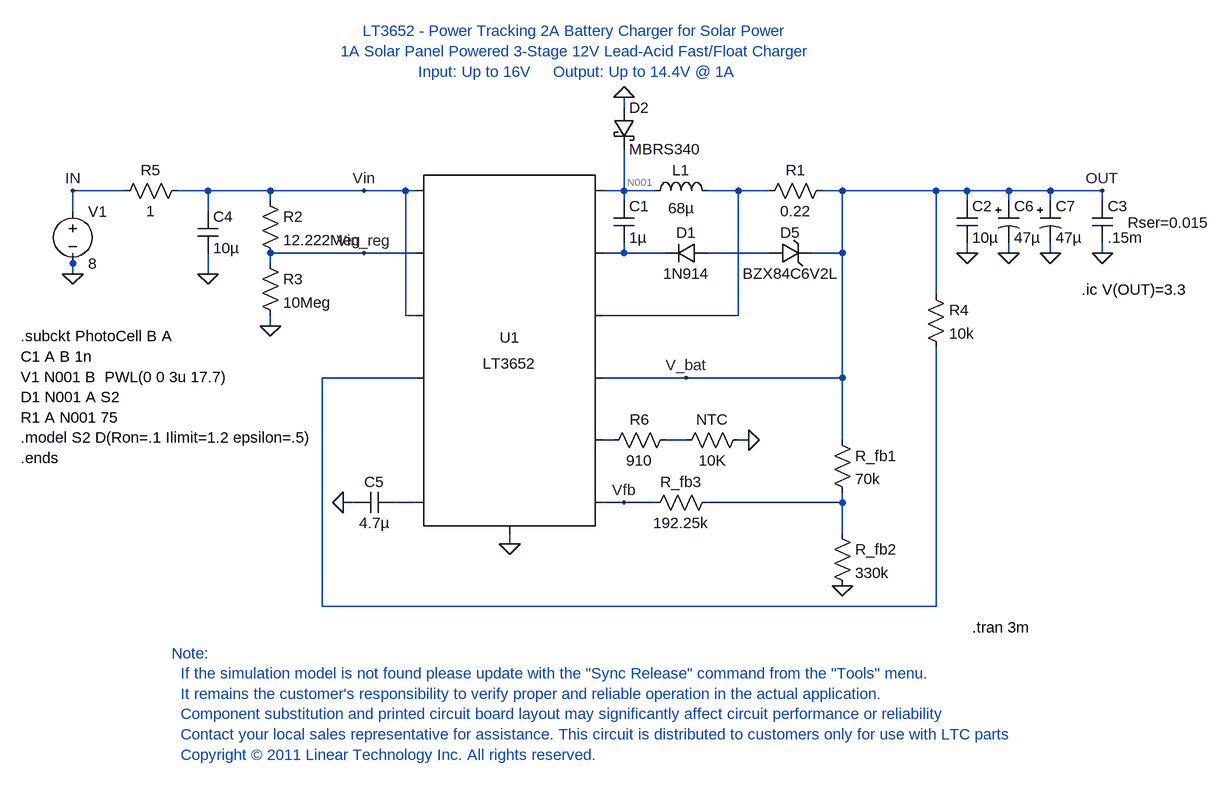
[diagram p0: schematic LT3652_TA04_const voltage source.asc]
LT3652_TA04_const voltage source.asc, the LTspice schematic file:
Version 4
SHEET 1 1484 932
WIRE 400 -192 400 -208
WIRE -368 -64 -448 -64
WIRE -240 -64 -288 -64
WIRE -144 -64 -240 -64
WIRE 0 -64 -144 -64
WIRE 64 -64 0 -64
WIRE 80 -64 64 -64
WIRE 400 -64 400 -128
WIRE 400 -64 368 -64
WIRE 448 -64 400 -64
WIRE 576 -64 528 -64
WIRE 624 -64 576 -64
WIRE 736 -64 704 -64
WIRE 880 -64 736 -64
WIRE 928 -64 880 -64
WIRE 992 -64 928 -64
WIRE 1056 -64 992 -64
WIRE 1136 -64 1056 -64
WIRE -144 -48 -144 -64
WIRE 400 -48 400 -64
WIRE 928 -48 928 -64
WIRE 992 -48 992 -64
WIRE 1056 -48 1056 -64
WIRE 1136 -48 1136 -64
WIRE -448 -32 -448 -64
WIRE -240 -32 -240 -64
WIRE 0 32 -144 32
WIRE 80 32 0 32
WIRE 400 32 400 16
WIRE 400 32 368 32
WIRE 464 32 400 32
WIRE 624 32 528 32
WIRE 736 32 736 -64
WIRE 736 32 688 32
WIRE 928 32 928 16
WIRE 992 32 992 16
WIRE 1056 32 1056 16
WIRE 1136 32 1136 16
WIRE -448 48 -448 32
WIRE -144 48 -144 32
WIRE -448 64 -448 48
WIRE -240 64 -240 32
WIRE 880 96 880 -64
WIRE 64 128 64 -64
WIRE 80 128 64 128
WIRE 576 128 576 -64
WIRE 576 128 368 128
WIRE -144 144 -144 128
WIRE 80 224 -64 224
WIRE 496 224 368 224
WIRE 736 224 736 32
WIRE 736 224 496 224
WIRE 384 320 368 320
WIRE 496 320 464 320
WIRE 592 320 576 320
WIRE 736 320 736 224
WIRE -16 416 -32 416
WIRE 80 416 48 416
WIRE 400 416 368 416
WIRE 448 416 400 416
WIRE 736 416 736 400
WIRE 736 416 528 416
WIRE 736 464 736 416
WIRE 224 480 224 464
WIRE -64 576 -64 224
WIRE 880 576 880 176
WIRE 880 576 -64 576
FLAG 224 480 0
FLAG 400 -208 0
FLAG -240 64 0
FLAG -32 416 0
FLAG 592 320 0
FLAG 928 32 0
FLAG 1136 32 0
FLAG -448 -64 IN
FLAG -448 64 0
FLAG 1136 -64 OUT
FLAG -144 144 0
FLAG 992 32 0
FLAG 736 544 0
FLAG 1056 32 0
FLAG 0 32 Vin_reg
FLAG 0 -64 Vin
FLAG 496 224 V_bat
FLAG 400 416 Vfb
DATAFLAG 464 128 ""
SYMBOL PowerProducts\\LT3652 224 176 R0
SYMATTR InstName U1
SYMBOL res 608 -48 R270
WINDOW 0 32 56 VTop 2
WINDOW 3 0 56 VBottom 2
SYMATTR InstName R1
SYMATTR Value 0.22
SYMBOL cap 384 -48 R0
SYMATTR InstName C1
SYMATTR Value 1µ
SYMBOL diode 528 16 R90
WINDOW 0 0 32 VBottom 2
WINDOW 3 32 32 VTop 2
SYMATTR InstName D1
SYMATTR Value 1N914
SYMBOL schottky 384 -192 R0
SYMATTR Value MBRS340
SYMATTR InstName D2
SYMATTR Description Diode
SYMATTR Type diode
SYMBOL res -160 -64 R0
SYMATTR InstName R2
SYMATTR Value 12.222Meg
SYMBOL res -160 32 R0
SYMATTR InstName R3
SYMATTR Value 10Meg
SYMBOL res 720 304 R0
SYMATTR InstName R_fb1
SYMATTR Value 70k
SYMBOL res 480 304 R90
WINDOW 0 0 56 VBottom 2
WINDOW 3 32 56 VTop 2
SYMATTR InstName R6
SYMATTR Value 910
SYMBOL res 544 400 R90
WINDOW 0 0 56 VBottom 2
WINDOW 3 32 56 VTop 2
SYMATTR InstName R_fb3
SYMATTR Value 192.25k
SYMBOL res 480 336 R270
WINDOW 0 32 56 VTop 2
WINDOW 3 0 56 VBottom 2
SYMATTR InstName NTC
SYMATTR Value 10K
SYMBOL cap 912 -48 R0
SYMATTR InstName C2
SYMATTR Value 10µ
SYMATTR SpiceLine Rser=0.003
SYMBOL zener 624 48 R270
WINDOW 0 32 32 VTop 2
WINDOW 3 0 32 VBottom 2
SYMATTR InstName D5
SYMATTR Value BZX84C6V2L
SYMATTR Description Diode
SYMATTR Type diode
SYMBOL cap -256 -32 R0
SYMATTR InstName C4
SYMATTR Value 10µ
SYMBOL cap 48 400 R90
WINDOW 0 0 32 VBottom 2
WINDOW 3 32 32 VTop 2
SYMATTR InstName C5
SYMATTR Value 4.7µ
SYMBOL ind 432 -48 R270
WINDOW 0 32 56 VTop 2
WINDOW 3 5 56 VBottom 2
SYMATTR InstName L1
SYMATTR Value 68µ
SYMATTR SpiceLine Ipk=1.7 Rser=0.11 Rpar=21068 Cpar=5.6p mfg="Wurth Elektronik" pn="7447779122 WE-PD M"
SYMBOL cap 1120 -48 R0
WINDOW 39 55 33 Left 2
SYMATTR SpiceLine Rser=0.015
SYMATTR InstName C3
SYMATTR Value .15m
SYMBOL res 720 448 R0
SYMATTR InstName R_fb2
SYMATTR Value 330k
SYMBOL res 864 80 R0
SYMATTR InstName R4
SYMATTR Value 10k
SYMBOL polcap 976 -48 R0
SYMATTR InstName C6
SYMATTR Value 47µ
SYMBOL polcap 1040 -48 R0
SYMATTR InstName C7
SYMATTR Value 47µ
SYMBOL voltage -448 -48 R0
WINDOW 123 0 0 Left 0
WINDOW 39 0 0 Left 0
SYMATTR InstName V1
SYMATTR Value 8
SYMBOL res -272 -80 R90
WINDOW 0 0 56 VBottom 2
WINDOW 3 32 56 VTop 2
SYMATTR InstName R5
SYMATTR Value 1
TEXT 936 608 Left 2 !.tran 3m
TEXT -528 160 Left 2 !.subckt PhotoCell B A\nC1 A B 1n\nV1 N001 B  PWL(0 0 3u 17.7)\nD1 N001 A S2\nR1 A N001 75\n.model S2 D(Ron=.1 Ilimit=1.2 epsilon=.5)\n.ends
TEXT 328 -232 Bottom 2 ;LT3652 - Power Tracking 2A Battery Charger for Solar Power\n1A Solar Panel Powered 3-Stage 12V Lead-Acid Fast/Float Charger\nInput: Up to 16V     Output: Up to 14.4V @ 1A
TEXT -296 648 Left 2 ;Note:\n  If the simulation model is not found please update with the "Sync Release" command from the "Tools" menu.\n  It remains the customer's responsibility to verify proper and reliable operation in the actual application.\n  Component substitution and printed circuit board layout may significantly affect circuit performance or reliability\n  Contact your local sales representative for assistance. This circuit is distributed to customers only for use with LTC parts\n  Copyright © 2011 Linear Technology Inc. All rights reserved.
TEXT 1104 88 Left 2 !.ic V(OUT)=3.3

The netlist it stands for:
* LT3652_TA04_const voltage source.asc
XU1 Vin Vin_reg Vin N005 NC_01 N008 Vfb N006 V_bat N002 N003 N001 0 LT3652
R1 N002 V_bat 0.22
C1 N001 N003 1µ
D1 N004 N003 1N914
D2 0 N001 MBRS340
R2 Vin Vin_reg 12.222Meg
R3 Vin_reg 0 10Meg
R_fb1 V_bat N009 70k
R6 N007 N006 910
R_fb3 N009 Vfb 192.25k
R§NTC N007 0 10K
C2 V_bat 0 10µ Rser=0.003
D5 N004 V_bat BZX84C6V2L
C4 Vin 0 10µ
C5 N008 0 4.7µ
L1 N001 N002 68µ Ipk=1.7 Rser=0.11 Rpar=21068 Cpar=5.6p mfg="Wurth Elektronik" pn="7447779122 WE-PD M"
C3 V_bat 0 .15m Rser=0.015
R_fb2 N009 0 330k
R4 V_bat N005 10k
C6 V_bat 0 47µ
C7 V_bat 0 47µ
V1 IN 0 8
R5 Vin IN 1
.model D D
.lib standard.dio
.tran 3m
.subckt PhotoCell B A
C1 A B 1n
V1 N001 B  PWL(0 0 3u 17.7)
D1 N001 A S2
R1 A N001 75
.model S2 D(Ron=.1 Ilimit=1.2 epsilon=.5)
.ends
* LT3652 - Power Tracking 2A Battery Charger for Solar Power
* 1A Solar Panel Powered 3-Stage 12V Lead-Acid Fast/Float Charger
* Input: Up to 16V     Output: Up to 14.4V @ 1A
* Note:
*   If the simulation model is not found please update with the "Sync Release" command from the "Tools" menu.
*   It remains the customer's responsibility to verify proper and reliable operation in the actual application.
*   Component substitution and printed circuit board layout may significantly affect circuit performance or reliability
*   Contact your local sales representative for assistance. This circuit is distributed to customers only for use with LTC parts
*   Copyright © 2011 Linear Technology Inc. All rights reserved.
.ic V(OUT)=3.3
.lib LT3652.sub
.backanno
.end